# EAGLE design interro-cpu-board-r1 (EAGLE 5.12)
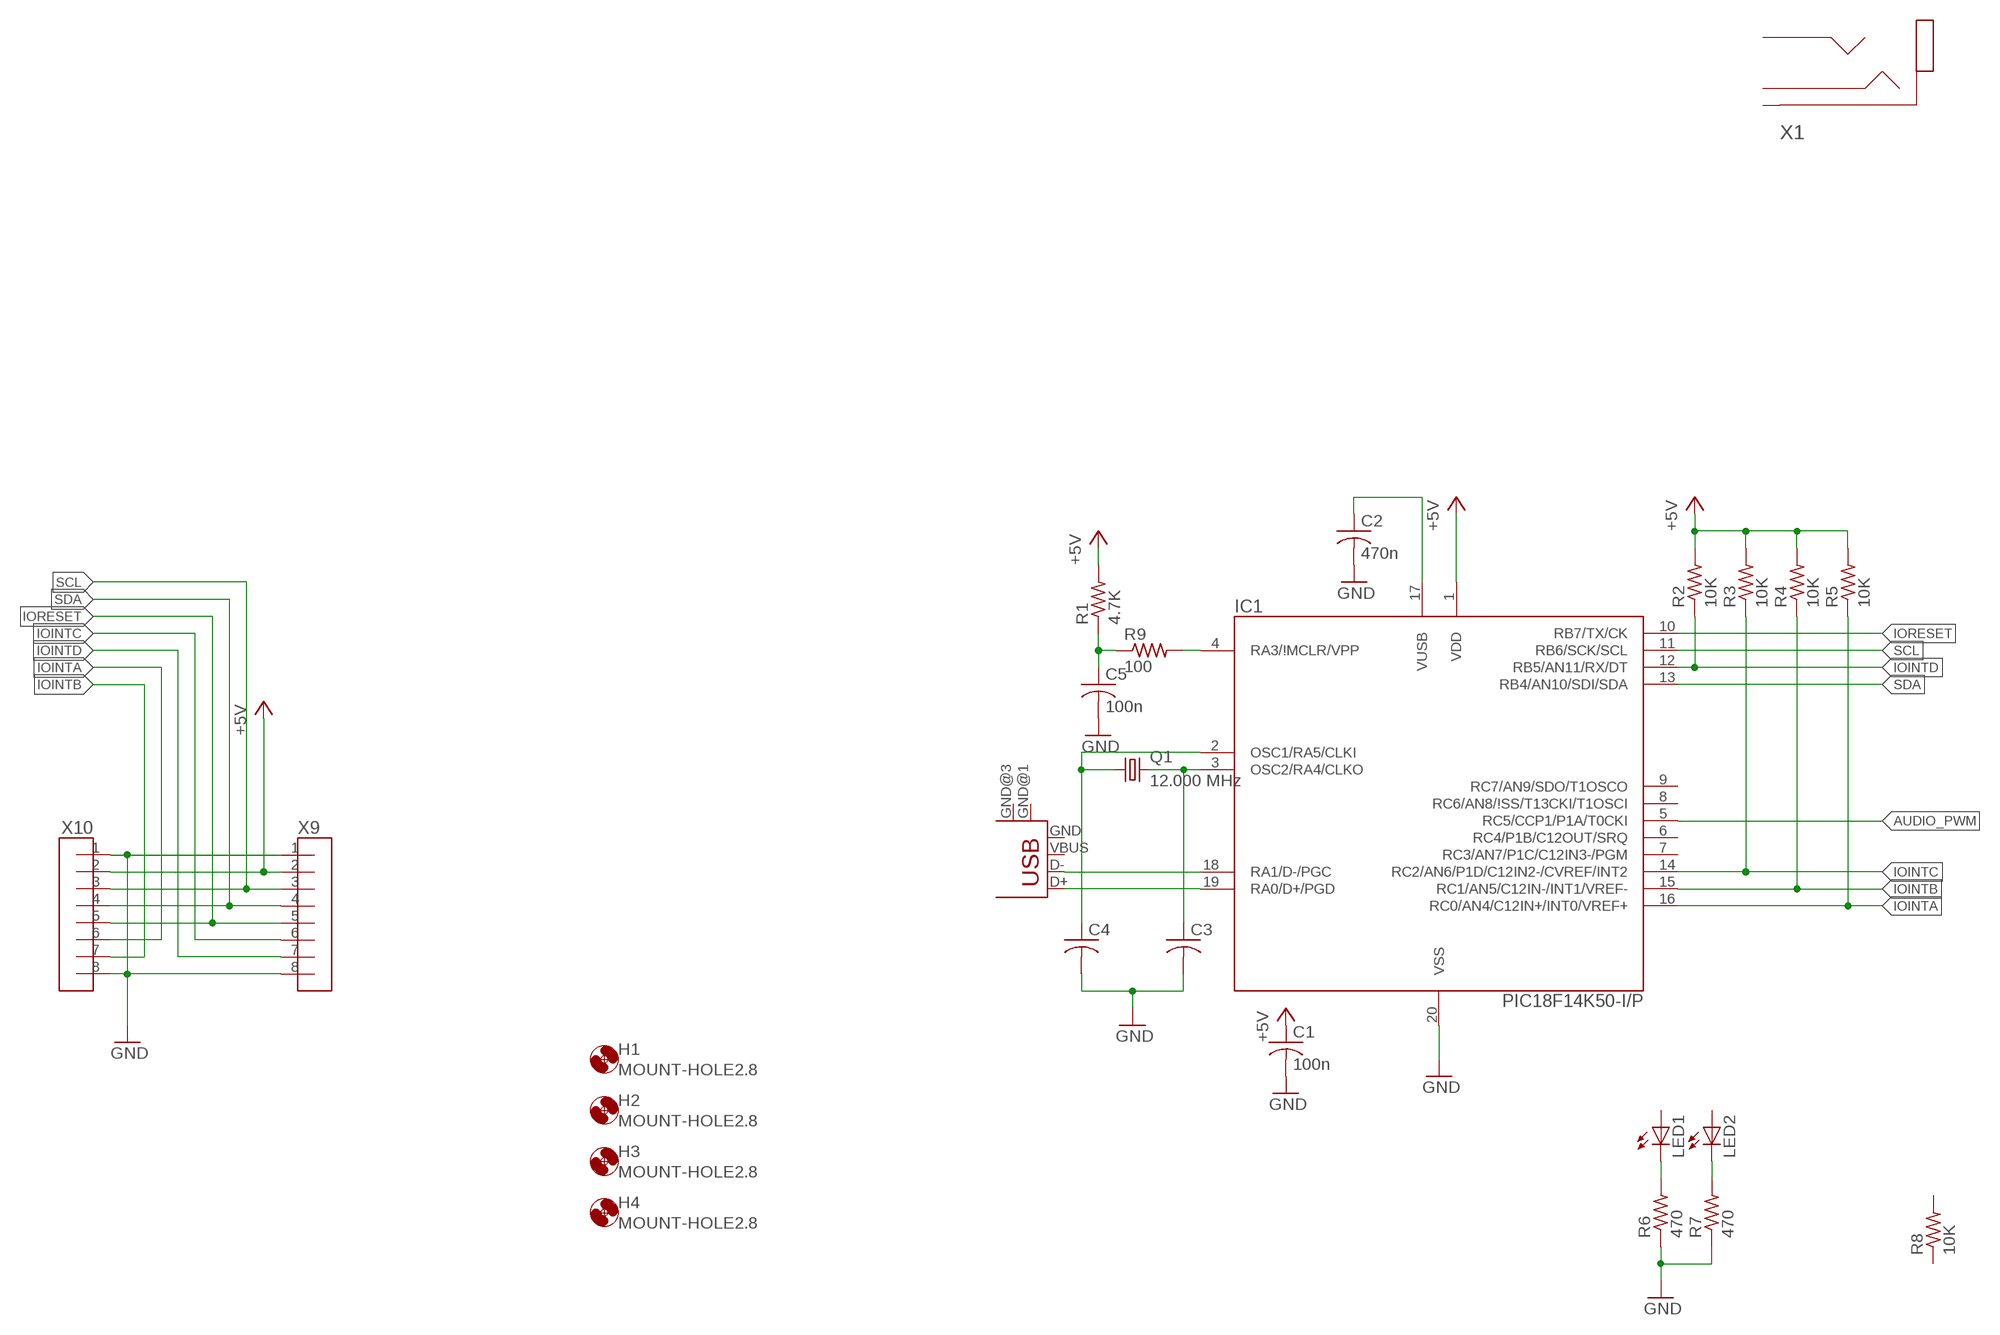
[diagram p0: schematic, sheet 1]

## Parts
C1  100n  C-US050-025X075  [C050-025X075]
C2  470n  C-US050-025X075  [C050-025X075]
C3  C-US025-025X050  [C025-025X050]
C4  C-US025-025X050  [C025-025X050]
C5  100n  C-US050-025X075  [C050-025X075]
H1  MOUNT-HOLE2.8  [2,8]
H2  MOUNT-HOLE2.8  [2,8]
H3  MOUNT-HOLE2.8  [2,8]
H4  MOUNT-HOLE2.8  [2,8]
IC1  PIC18F14K50-I/P  [DIP-20]
LED1  LED3MM  [LED3MM]
LED2  LED3MM  [LED3MM]
Q1  12.000 MHz  CRYSTALHC49S  [HC49/S]
R1  4.7K  R-US_0207/2V  [0207/2V]
R2  10K  R-US_0207/2V  [0207/2V]
R3  10K  R-US_0207/2V  [0207/2V]
R4  10K  R-US_0207/2V  [0207/2V]
R5  10K  R-US_0207/2V  [0207/2V]
R6  470  R-US_0207/10  [0207/10]
R7  470  R-US_0207/10  [0207/10]
R8  10K  R-US_0207/10  [0207/10]
R9  100  R-US_0207/2V  [0207/2V]
USB1  USB-RAYMOND  [USB-MB-RAYMOND]
X1  SJ1-3533N  [SJ1-3533N]
X9  M08-100MIL  [100MIL-8]
X10  M08-100MIL  [100MIL-8]

## Nets
+5V: C1.1 IC1.1(VDD) R1.2 R2.2 R3.2 R4.2 R5.2 X9.2 X10.2
AUDIO_PWM: IC1.5(RC5/CCP1/P1A/T0CKI)
GND: C1.2 C2.2 C3.2 C4.2 C5.2 IC1.20(VSS) R6.1 R7.1 X9.1 X9.8 X10.1 X10.8
IOINTA: IC1.16(RC0/AN4/C12IN+/INT0/VREF+) R5.1 X10.6
IOINTB: IC1.15(RC1/AN5/C12IN-/INT1/VREF-) R4.1 X10.7
IOINTC: IC1.14(RC2/AN6/P1D/C12IN2-/CVREF/INT2) R3.1 X9.6
IOINTD: IC1.12(RB5/AN11/RX/DT) R2.1 X9.7
IORESET: IC1.10(RB7/TX/CK) X9.5 X10.5
N$1: IC1.19(RA0/D+/PGD) USB1.D+
N$2: IC1.18(RA1/D-/PGC) USB1.D-
N$3: C4.1 IC1.2(OSC1/RA5/CLKI) Q1.1
N$4: C3.1 IC1.3(OSC2/RA4/CLKO) Q1.2
N$5: C2.1 IC1.17(VUSB)
N$6: LED1.K(C) R6.2
N$7: IC1.4(RA3/\!MCLR/VPP) R9.2
N$8: C5.1 R1.1 R9.1
N$9: LED2.K(C) R7.2
SCL: IC1.11(RB6/SCK/SCL) X9.3 X10.3
SDA: IC1.13(RB4/AN10/SDI/SDA) X9.4 X10.4
Unconnected: IC1.6(RC4/P1B/C12OUT/SRQ) IC1.7(RC3/AN7/P1C/C12IN3-/PGM) IC1.8(RC6/AN8/\!SS/T13CKI/T1OSCI) IC1.9(RC7/AN9/SDO/T1OSCO) LED1.A LED2.A R8.1 R8.2 USB1.GND USB1.GND@1(GND) USB1.GND@3(GND) USB1.VBUS X1.RING X1.SHIELD(SLEEVE) X1.TIP

## Library data of the parts
C1-C5 = rcl:C-US: CAPACITOR, American symbol
H1-H4 = holes:MOUNT-HOLE: MOUNTING HOLE with drill center marker
IC1 = rbg-microchip-pic18:PIC18F14K50-I
LED1 LED2 = led:LED: LED OSRAM: - CHIPLED LG R971, LG N971, LY N971, LG Q971, LY Q971, LO R971, LY R971 LH N974, LH R974 LS Q976, LO Q976, LY Q976 LO Q996 - Hyper CHIPLED LW Q18S LB Q993, LB Q99A, LB R99A - SideLED LS A670, LO A670, LY A670, LG A670, LP A670 LB A673, LV A673, LT A673, LW A673 LH A674 LY A675 LS A676, LA A676, LO A676, LY A676, LW A676 LS A679, LY A679, LG A679 - Hyper Micro SIDELED® LS Y876, LA Y876, LO Y876, LY Y876 LT Y87S - SmartLED LW L88C, LW L88S LB L89C, LB L89S, LG L890 LS L89K, LO L89K, LY L89K LS L896, LA L896, LO L896, LY L896 - TOPLED LS T670, LO T670, LY T670, LG T670, LP T670 LSG T670, LSP T670, LSY T670, LOP T670, LYG T670 LG T671, LOG T671, LSG T671 LB T673, LV T673, LT T673, LW T673 LH T674 LS T676, LA T676, LO T676, LY T676, LB T676, LH T676, LSB T676, LW T676 LB T67C, LV T67C, LT T67C, LS T67K, LO T67K, LY T67K, LW E67C LS E67B, LA E67B, LO E67B, LY E67B, LB E67C, LV E67C, LT E67C LW T67C LS T679, LY T679, LG T679 LS T770, LO T770, LY T770, LG T770, LP T770 LB T773, LV T773, LT T773, LW T773 LH T774 LS E675, LA E675, LY E675, LS T675 LS T776, LA T776, LO T776, LY T776, LB T776 LHGB T686 LT T68C, LB T68C - Hyper Mini TOPLED® LB M676 - Mini TOPLED Santana® LG M470 LS M47K, LO M47K, LY M47K Source: http://www.osram.convergy.de LUXEON: - LUMILED® LXK2-PW12-R00, LXK2-PW12-S00, LXK2-PW14-U00, LXK2-PW14-V00 LXK2-PM12-R00, LXK2-PM12-S00, LXK2-PM14-U00 LXK2-PE12-Q00, LXK2-PE12-R00, LXK2-PE12-S00, LXK2-PE14-T00, LXK2-PE14-U00 LXK2-PB12-K00, LXK2-PB12-L00, LXK2-PB12-M00, LXK2-PB14-N00, LXK2-PB14-P00, LXK2-PB14-Q00 LXK2-PR12-L00, LXK2-PR12-M00, LXK2-PR14-Q00, LXK2-PR14-R00 LXK2-PD12-Q00, LXK2-PD12-R00, LXK2-PD12-S00 LXK2-PH12-R00, LXK2-PH12-S00 LXK2-PL12-P00, LXK2-PL12-Q00, LXK2-PL12-R00 Source: www.luxeon.com KINGBRIGHT: KA-3528ASYC Source: www.kingbright.com
Q1 = crystal:CRYSTAL: CRYSTAL; OC_FARNELL: 1667008; OC_NEWARK: unknown
R1-R9 = rcl:R-US_: RESISTOR, American symbol
USB1 = con-usb-2:USB: USB Connectors
X1 = rbg-cui-audio:SJ1-3533N
X9 X10 = rbg-generic-headers:M08-100MIL

## Board
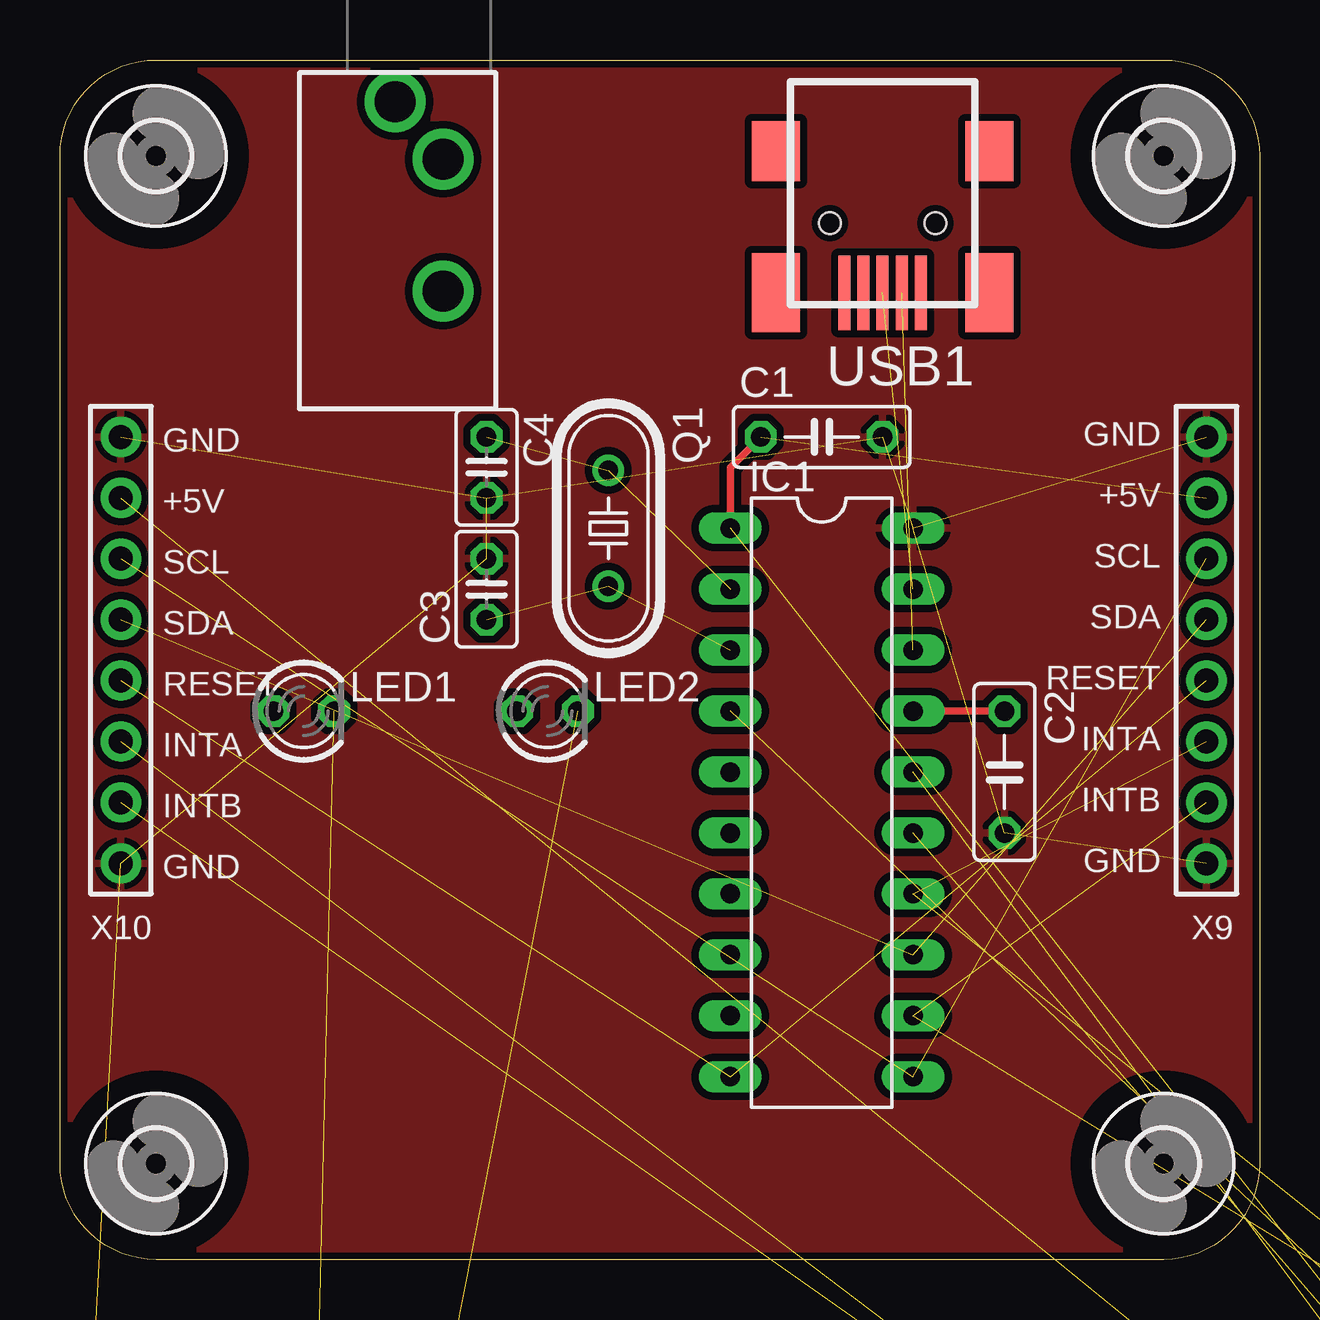
[diagram p1: board, top side]
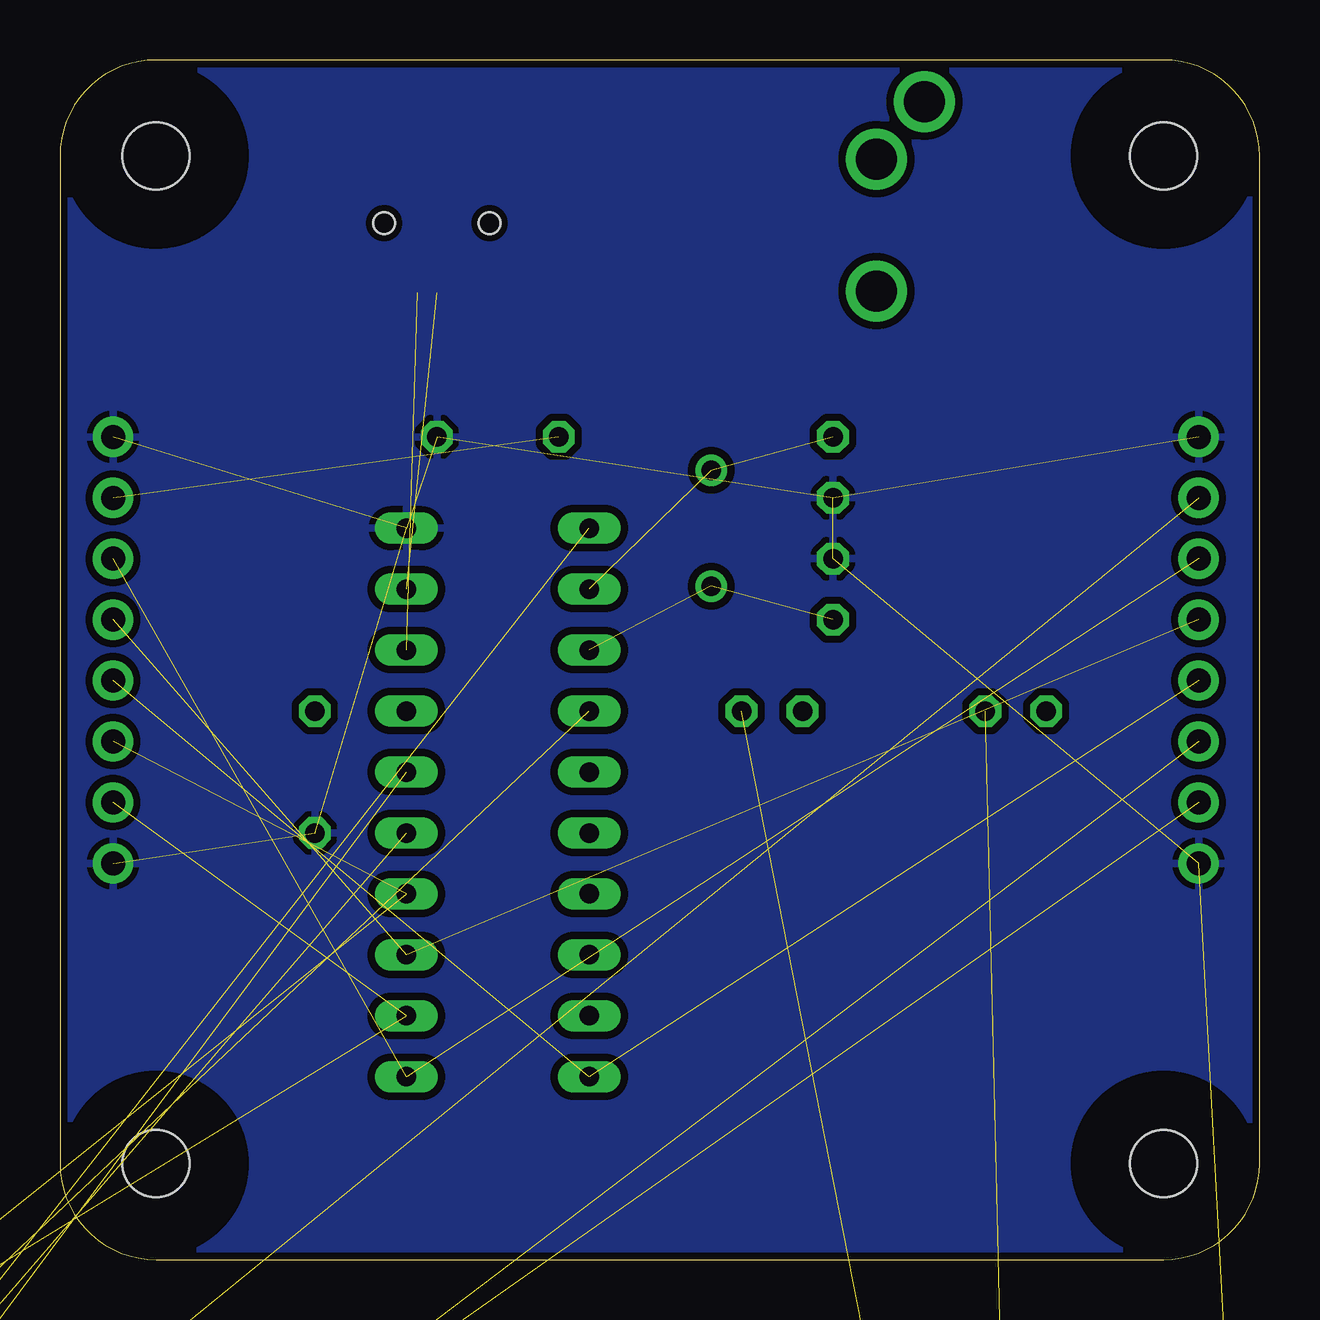
[diagram p2: board, bottom side, seen from below]

Size 50 x 50 mm. Coordinates in mm from the lower left corner, seen from the top.
Outline: 0,46 arc-90 4,50 46,50 arc-90 50,46 50,4 arc-90 46,0 4,0 arc-90 0,4 0,46
Copper layers (1*16): Top 0.035mm / dielectric 1.5mm / Bottom 0.035mm
Design rules "default *": minimum track width 10mil, minimum drill 19mil, track to track 10mil, track to pad 10mil, pad to pad 10mil, via to via 10mil, smd to smd 10mil, copper to edge 10mil, drill to drill 8mil, minimum pad ring 10mil, minimum via ring 8mil, stop-mask expansion 4mil, vias tented up to drill 20mil, thermal gap 10mil

### Footprints (pad centres in the part's own frame; a part is rotated, then mirrored left to right if it is on the bottom)
C050-025X075 = drill 0.813 octagon: 1 -2.54,0; 2 2.54,0
C025-025X050 = drill 0.813 octagon: 1 -1.27,0; 2 1.27,0
2,8 = hole 2.8: 0,0
DIP-20 = drill 0.813 long: 1 -11.43,-3.81; 2 -8.89,-3.81; 3 -6.35,-3.81; 4 -3.81,-3.81; 5 -1.27,-3.81; 6 1.27,-3.81; 7 3.81,-3.81; 8 6.35,-3.81; 9 8.89,-3.81; 10 11.43,-3.81; 11 11.43,3.81; 12 8.89,3.81; 13 6.35,3.81; 14 3.81,3.81; 15 1.27,3.81; 16 -1.27,3.81; 17 -3.81,3.81; 18 -6.35,3.81; 19 -8.89,3.81; 20 -11.43,3.81
LED3MM = drill 0.813 octagon: A -1.27,0; K 1.27,0
HC49/S = drill 0.813 round: 1 -2.413,0; 2 2.413,0
0207/2V = drill 0.813 octagon: 1 -1.27,0; 2 1.27,0
0207/10 = drill 0.813 octagon: 1 -5.08,0; 2 5.08,0
USB-MB-RAYMOND = smd 0.5 x 3.1: D+ 0,4.15; D- -0.8,4.15; GND 1.6,4.15; ID 0.8,4.15; VBUS -1.6,4.15 | smd 2 x 2.5: GND@1 -4.45,-1.75; GND@3 4.45,-1.75 | smd 2 x 3.3: GND@2 -4.45,4.15; GND@4 4.45,4.15 | hole 0.9: -2.2,1.25; 2.2,1.25
SJ1-3533N = drill 1.7 round: RING 7.9,2; SHIELD 0,0; TIP 2.4,2
100MIL-8 = drill 1 pad 1.676 round: 1 -8.89,0; 2 -6.35,0; 3 -3.81,0; 4 -1.27,0; 5 1.27,0; 6 3.81,0; 7 6.35,0; 8 8.89,0

### Placement (x,y rotation side)
C1  31.75,34.29 0 top
C2  39.37,20.32 270 top
C3  17.78,27.94 90 top
C4  17.78,33.02 270 top
C5  2.54,-50.8 0 top  (outside the outline)
H1  4,4 0 top
H2  4,46 0 top
H3  46,46 0 top
H4  46,4 0 top
IC1  31.75,19.05 270 top
LED1  10.16,22.86 0 top
LED2  20.32,22.86 0 top
Q1  22.86,30.48 270 top
R1  86.36,-35.56 180 top  (outside the outline)
R2  105.41,-31.75 0 top  (outside the outline)
R3  93.98,-30.48 0 top  (outside the outline)
R4  85.09,-38.1 0 top  (outside the outline)
R5  77.47,-34.29 0 top  (outside the outline)
R6  5.08,-30.48 0 top  (outside the outline)
R7  5.08,-35.56 0 top  (outside the outline)
R8  5.08,-40.64 0 top  (outside the outline)
R9  93.98,-40.64 0 top  (outside the outline)
USB1  34.29,44.45 180 top
X1  13.97,48.26 270 top
X9  47.79,25.4 270 top
X10  2.54,25.4 270 top

### Tracks (layer width: path | path; a pad name or v marks a point on that pad's centre or on a via)
+5V  (7 unrouted)
  Top 0.305: IC1.1 27.94,33.02 C1.1
GND  (11 unrouted)
  pour Bottom (isolate 0.305): -1.27,50.8 50.33,50.8 50.33,-1.27 -1.27,-1.27
  pour Top (isolate 0.305): -1.27,50.8 50.33,50.8 50.33,-1.27 -1.27,-1.27
IOINTA  (2 unrouted)
IOINTB  (2 unrouted)
IOINTC  (2 unrouted)
IOINTD  (2 unrouted)
IORESET  (2 unrouted)
N$1  (1 unrouted)
N$2  (1 unrouted)
N$3  (2 unrouted)
N$4  (2 unrouted)
N$5
  Top 0.305: IC1.17 C2.1
N$6  (1 unrouted)
N$7  (1 unrouted)
N$8  (2 unrouted)
N$9  (1 unrouted)
SCL  (2 unrouted)
SDA  (2 unrouted)

### Text on the board
tNames: GND | GND | +5V | +5V | SCL | SCL | SDA | SDA | RESET | RESET | INTA | INTA | INTB | INTB | GND | GND